# EAGLE schematic matherBoard (EAGLE 9.3.1)

## Sheet 1 of 2
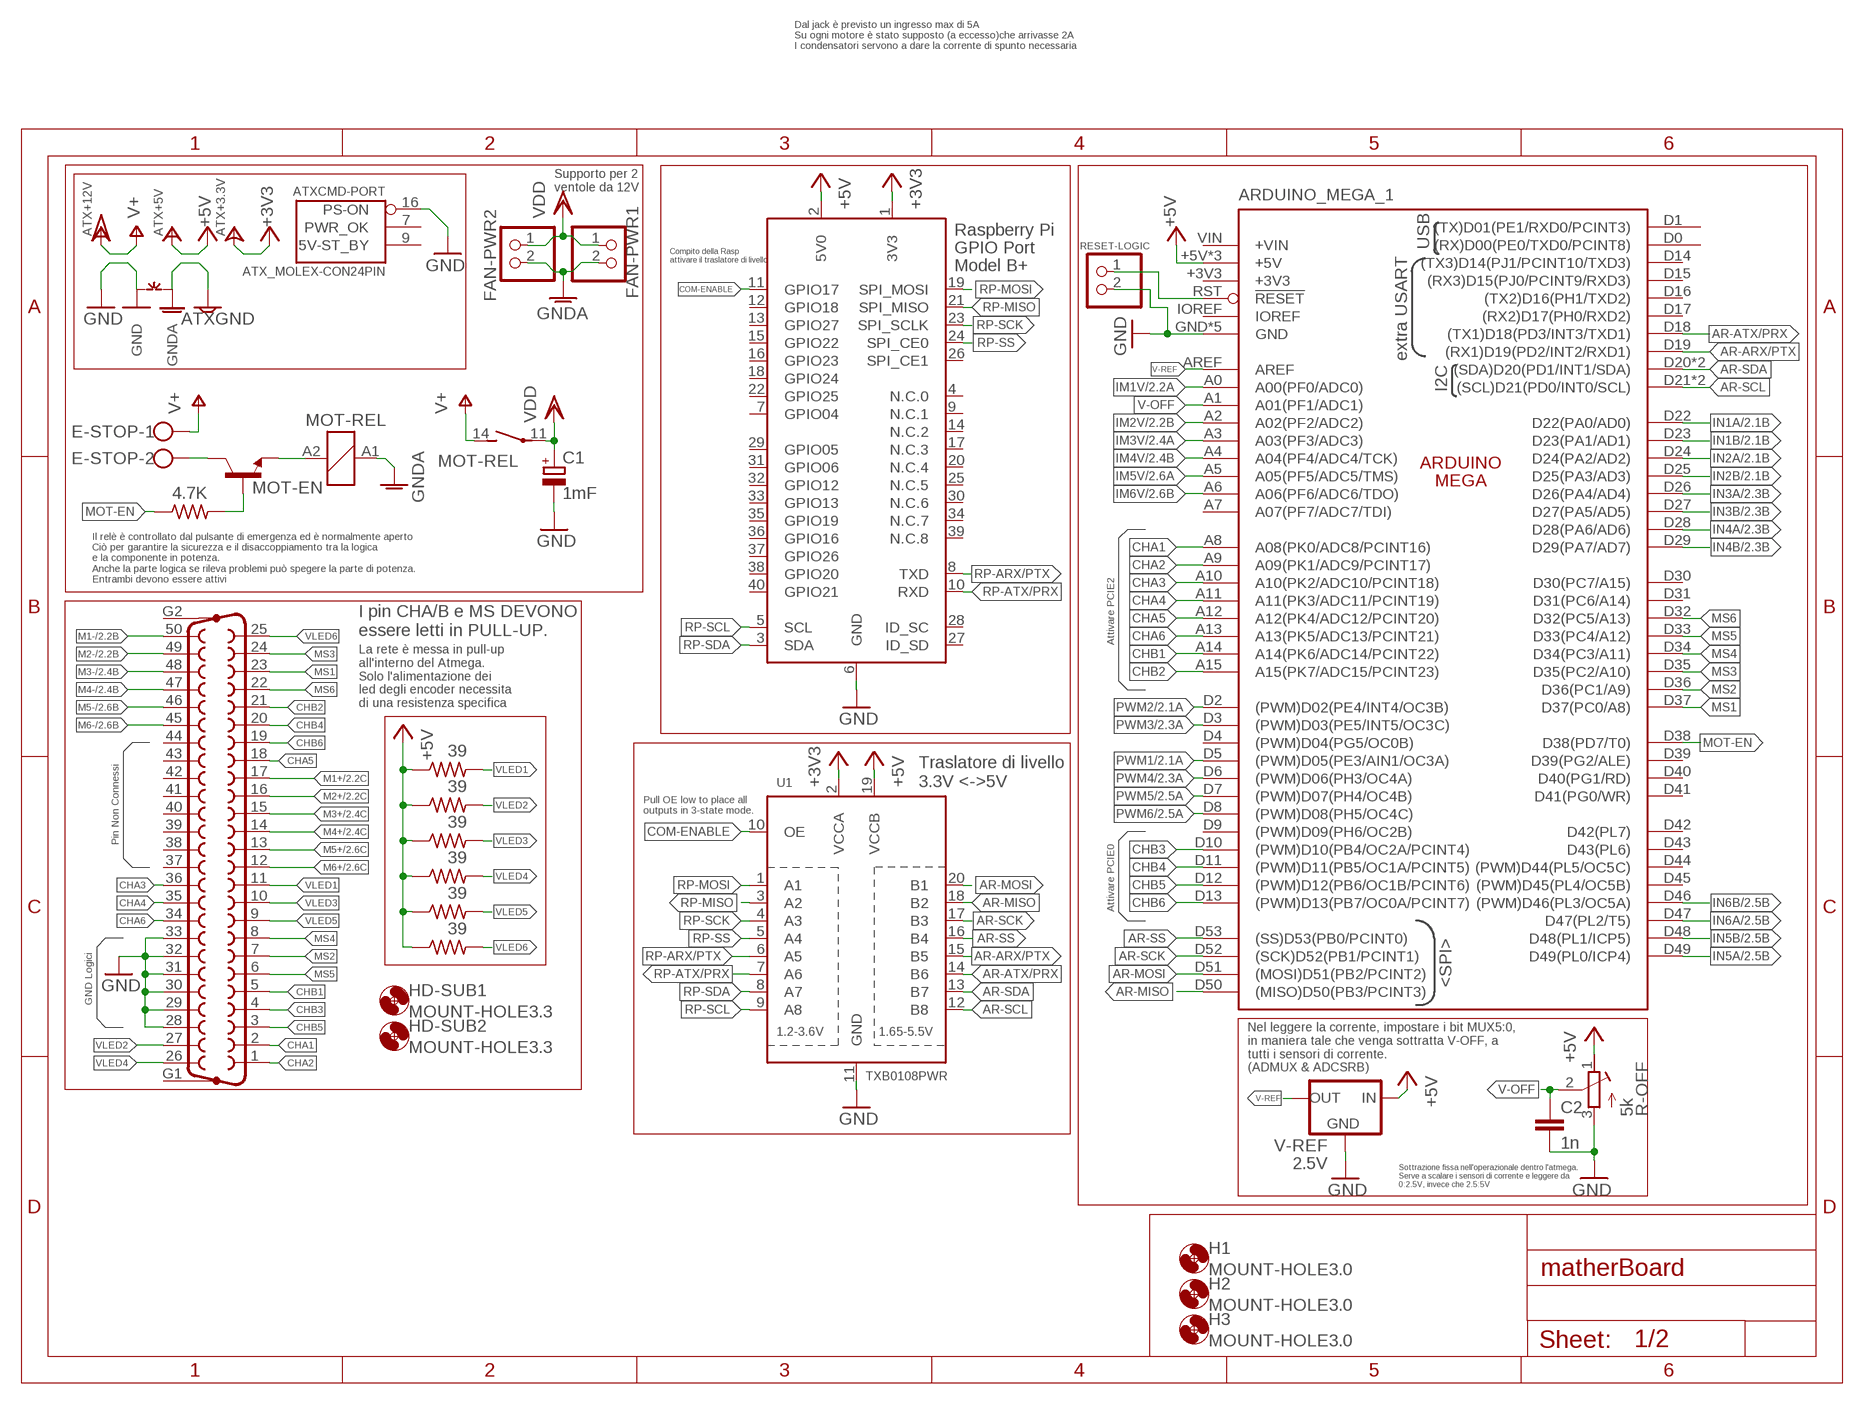
[diagram p0: schematic, sheet 1]

### Parts
ARDUINO_MEGA_1  MEGA_ARDUINONO-HOLE  [MEGA-NO-HOLE]
ATX  ATX_MOLEX-CON24PIN  [5566-24]
C1  1mF  CPOL-EUE5-13  [E5-13]
C2  1n  C-EU025-024X044  [C025-024X044]
D-SUB50  F50VP  [F50VP]
E-STOP  W237-102  [W237-102]
FAN-PWR1  PINHD-1X2  [1X02]
FAN-PWR2  PINHD-1X2  [1X02]
H1  MOUNT-HOLE3.0  [3,0]
H2  MOUNT-HOLE3.0  [3,0]
H3  MOUNT-HOLE3.0  [3,0]
HD-SUB1  MOUNT-HOLE3.3  [3,3]
HD-SUB2  MOUNT-HOLE3.3  [3,3]
MOT-EN  2N5550-NPN-TO92-CBE  [TO92-CBE]
MOT-REL  RP530006  [RP53]
R1  39  R-US_0204/5  [0204/5]
R2  39  R-US_0204/5  [0204/5]
R3  39  R-US_0204/5  [0204/5]
R4  39  R-US_0204/5  [0204/5]
R5  39  R-US_0204/5  [0204/5]
R6  39  R-US_0204/5  [0204/5]
R7  4.7K  R-US_0204/7  [0204/7]
R-OFF  5k  R-TRIMMT93YA  [RTRIMT93YA]
RASPBERRY-PY  RASPI_GPIO_B+_BOX  [RASPI_GPIO_B+_BOX]
RESET-LOGIC  PINHD-1X2  [1X02]
U1  TXB0108PWR  [TSSOP20]
V-REF  2.5V  XC63FPM  [SOT23]
~NUDEV~1  GND-GNDA1,27MM  [GND-GNDA-1,27MM]

### Nets
+3V3: ATX.1(+3.3V:+3V3-ATX) ATX.2(+3.3V:+3V3-ATX) ATX.12(+3.3V:+3V3-ATX) ATX.13(+3.3V:+3V3-ATX) RASPBERRY-PY.1(3V3) U1.2(VCCA)
+5V [PLogic]: ARDUINO_MEGA_1.+5V ARDUINO_MEGA_1.+5V1(+5V) ARDUINO_MEGA_1.+5V2(+5V) ATX.4(+5V:+5V-ATX) ATX.6(+5V:+5V-ATX) ATX.21(+5V:+5V-ATX) ATX.22(+5V:+5V-ATX) ATX.23(+5V:+5V-ATX) R1.1 R2.1 R3.1 R4.1 R5.1 R6.1 R-OFF.1(E) RASPBERRY-PY.2(5V0) U1.19(VCCB) V-REF.3(IN) ; also sheet 2
AR-ARX/PTX: ARDUINO_MEGA_1.D19((RX1)D19(PD2/INT2/RXD1)) U1.15(B5)
AR-ATX/PRX: ARDUINO_MEGA_1.D18((TX1)D18(PD3/INT3/TXD1)) U1.14(B6)
AR-MISO: ARDUINO_MEGA_1.D50((MISO)D50(PB3/PCINT3)) U1.18(B2)
AR-MOSI: ARDUINO_MEGA_1.D51((MOSI)D51(PB2/PCINT2)) U1.20(B1)
AR-SCK: ARDUINO_MEGA_1.D52((SCK)D52(PB1/PCINT1)) U1.17(B3)
AR-SCL: ARDUINO_MEGA_1.D21((SCL)D21(PD0/INT0/SCL)) ARDUINO_MEGA_1.SCL1((SCL)D21(PD0/INT0/SCL)) U1.12(B8)
AR-SDA: ARDUINO_MEGA_1.D20((SDA)D20(PD1/INT1/SDA)) ARDUINO_MEGA_1.SDA1((SDA)D20(PD1/INT1/SDA)) U1.13(B7)
AR-SS: ARDUINO_MEGA_1.D53((SS)D53(PB0/PCINT0)) U1.16(B4)
CHA1: ARDUINO_MEGA_1.A8(A08(PK0/ADC8/PCINT16)) D-SUB50.2
CHA2: ARDUINO_MEGA_1.A9(A09(PK1/ADC9/PCINT17)) D-SUB50.1
CHA3: ARDUINO_MEGA_1.A10(A10(PK2/ADC10/PCINT18)) D-SUB50.36
CHA4: ARDUINO_MEGA_1.A11(A11(PK3/ADC11/PCINT19)) D-SUB50.35
CHA5: ARDUINO_MEGA_1.A12(A12(PK4/ADC12/PCINT20)) D-SUB50.18
CHA6: ARDUINO_MEGA_1.A13(A13(PK5/ADC13/PCINT21)) D-SUB50.34
CHB1: ARDUINO_MEGA_1.A14(A14(PK6/ADC14/PCINT22)) D-SUB50.5
CHB2: ARDUINO_MEGA_1.A15(A15(PK7/ADC15/PCINT23)) D-SUB50.21
CHB3: ARDUINO_MEGA_1.D10((PWM)D10(PB4/OC2A/PCINT4)) D-SUB50.4
CHB4: ARDUINO_MEGA_1.D11((PWM)D11(PB5/OC1A/PCINT5)) D-SUB50.20
CHB5: ARDUINO_MEGA_1.D12((PWM)D12(PB6/OC1B/PCINT6)) D-SUB50.3
CHB6: ARDUINO_MEGA_1.D13((PWM)D13(PB7/OC0A/PCINT7)) D-SUB50.19
COM-ENABLE: RASPBERRY-PY.11(GPIO17) U1.10(OE)
GND [PLogic]: ARDUINO_MEGA_1.GND ARDUINO_MEGA_1.GND1(GND) ARDUINO_MEGA_1.GND2(GND) ARDUINO_MEGA_1.GND3(GND) ARDUINO_MEGA_1.GND4(GND) ATX.16(CMD-PORT:PS-ON) C1.- C2.2 D-SUB50.28 D-SUB50.29 D-SUB50.30 D-SUB50.31 D-SUB50.32 D-SUB50.33 R-OFF.3(A) RASPBERRY-PY.6(GND) RESET-LOGIC.2 U1.11(GND) V-REF.1(GND) ~NUDEV~1.GND ; also sheet 2
GNDA [PowerJack]: ATX.3(GND:GND-ATX) ATX.5(GND:GND-ATX) ATX.8(GND:GND-ATX) ATX.15(GND:GND-ATX) ATX.17(GND:GND-ATX) ATX.18(GND:GND-ATX) ATX.19(GND:GND-ATX) ATX.24(GND:GND-ATX) FAN-PWR1.2 FAN-PWR2.2 MOT-REL.A1 ~NUDEV~1.GNDA ; also sheet 2
IM1V: ARDUINO_MEGA_1.A0(A00(PF0/ADC0)) ; also sheet 2
IM2V: ARDUINO_MEGA_1.A2(A02(PF2/ADC2)) ; also sheet 2
IM3V: ARDUINO_MEGA_1.A3(A03(PF3/ADC3)) ; also sheet 2
IM4V: ARDUINO_MEGA_1.A4(A04(PF4/ADC4/TCK)) ; also sheet 2
IM5V: ARDUINO_MEGA_1.A5(A05(PF5/ADC5/TMS)) ; also sheet 2
IM6V: ARDUINO_MEGA_1.A6(A06(PF6/ADC6/TDO)) ; also sheet 2
IN1A [PLogic]: ARDUINO_MEGA_1.D22(D22(PA0/AD0)) ; also sheet 2
IN1B [PLogic]: ARDUINO_MEGA_1.D23(D23(PA1/AD1)) ; also sheet 2
IN2A [PLogic]: ARDUINO_MEGA_1.D24(D24(PA2/AD2)) ; also sheet 2
IN2B [PLogic]: ARDUINO_MEGA_1.D25(D25(PA3/AD3)) ; also sheet 2
IN3A [PLogic]: ARDUINO_MEGA_1.D26(D26(PA4/AD4)) ; also sheet 2
IN3B [PLogic]: ARDUINO_MEGA_1.D27(D27(PA5/AD5)) ; also sheet 2
IN4A [PLogic]: ARDUINO_MEGA_1.D28(D28(PA6/AD6)) ; also sheet 2
IN4B [PLogic]: ARDUINO_MEGA_1.D29(D29(PA7/AD7)) ; also sheet 2
IN5A [PLogic]: ARDUINO_MEGA_1.D49(D49(PL0/ICP4)) ; also sheet 2
IN5B [PLogic]: ARDUINO_MEGA_1.D48(D48(PL1/ICP5)) ; also sheet 2
IN6A [PLogic]: ARDUINO_MEGA_1.D47(D47(PL2/T5)) ; also sheet 2
IN6B [PLogic]: ARDUINO_MEGA_1.D46((PWM)D46(PL3/OC5A)) ; also sheet 2
M1+ [PMot]: D-SUB50.17 ; also sheet 2
M1- [PMot]: D-SUB50.50 ; also sheet 2
M2+ [PMot]: D-SUB50.16 ; also sheet 2
M2- [PMot]: D-SUB50.49 ; also sheet 2
M3+ [PMot]: D-SUB50.15 ; also sheet 2
M3- [PMot]: D-SUB50.48 ; also sheet 2
M4+ [PMot]: D-SUB50.14 ; also sheet 2
M4- [PMot]: D-SUB50.47 ; also sheet 2
M5+ [PMot]: D-SUB50.13 ; also sheet 2
M5- [PMot]: D-SUB50.46 ; also sheet 2
M6+ [PMot]: D-SUB50.12 ; also sheet 2
M6- [PMot]: D-SUB50.45 ; also sheet 2
MOT-EN: ARDUINO_MEGA_1.D38(D38(PD7/T0)) R7.1
MS1: ARDUINO_MEGA_1.D37(D37(PC0/A8)) D-SUB50.23
MS2: ARDUINO_MEGA_1.D36(D36(PC1/A9)) D-SUB50.7
MS3: ARDUINO_MEGA_1.D35(D35(PC2/A10)) D-SUB50.24
MS4: ARDUINO_MEGA_1.D34(D34(PC3/A11)) D-SUB50.8
MS5: ARDUINO_MEGA_1.D33(D33(PC4/A12)) D-SUB50.6
MS6: ARDUINO_MEGA_1.D32(D32(PC5/A13)) D-SUB50.22
N$1 [PLogic]: E-STOP.2 MOT-EN.C
N$2: MOT-EN.B R7.2
N$3: MOT-EN.E MOT-REL.A2
N$5: ARDUINO_MEGA_1.RST(!RESET) RESET-LOGIC.1
PWM1 [PLogic]: ARDUINO_MEGA_1.D5((PWM)D05(PE3/AIN1/OC3A)) ; also sheet 2
PWM2 [PLogic]: ARDUINO_MEGA_1.D2((PWM)D02(PE4/INT4/OC3B)) ; also sheet 2
PWM3 [PLogic]: ARDUINO_MEGA_1.D3((PWM)D03(PE5/INT5/OC3C)) ; also sheet 2
PWM4 [PLogic]: ARDUINO_MEGA_1.D6((PWM)D06(PH3/OC4A)) ; also sheet 2
PWM5 [PLogic]: ARDUINO_MEGA_1.D7((PWM)D07(PH4/OC4B)) ; also sheet 2
PWM6 [PLogic]: ARDUINO_MEGA_1.D8((PWM)D08(PH5/OC4C)) ; also sheet 2
RP-ARX/PTX: RASPBERRY-PY.8(TXD) U1.6(A5)
RP-ATX/PRX: RASPBERRY-PY.10(RXD) U1.7(A6)
RP-MISO: RASPBERRY-PY.21(SPI_MISO) U1.3(A2)
RP-MOSI: RASPBERRY-PY.19(SPI_MOSI) U1.1(A1)
RP-SCK: RASPBERRY-PY.23(SPI_SCLK) U1.4(A3)
RP-SCL: RASPBERRY-PY.5(SCL) U1.9(A8)
RP-SDA: RASPBERRY-PY.3(SDA) U1.8(A7)
RP-SS: RASPBERRY-PY.24(SPI_CE0) U1.5(A4)
V+ [PowerJack]: ATX.10(+12V:VCC/2) ATX.11(+12V:VCC/2) E-STOP.1 MOT-REL.14(2:S)
V-OFF: ARDUINO_MEGA_1.A1(A01(PF1/ADC1)) C2.1 R-OFF.2(S)
V-REF: ARDUINO_MEGA_1.AREF V-REF.2(OUT)
VDD [PowerJack]: C1.+ FAN-PWR1.1 FAN-PWR2.1 MOT-REL.11(2:P) ; also sheet 2
VLED1 [PLogic]: D-SUB50.11 R1.2
VLED2 [PLogic]: D-SUB50.27 R2.2
VLED3 [PLogic]: D-SUB50.10 R3.2
VLED4 [PLogic]: D-SUB50.26 R4.2
VLED5 [PLogic]: D-SUB50.9 R5.2
VLED6 [PLogic]: D-SUB50.25 R6.2
Unconnected: ARDUINO_MEGA_1.+3V3 ARDUINO_MEGA_1.A7(A07(PF7/ADC7/TDI)) ARDUINO_MEGA_1.D0((RX)D00(PE0/TXD0/PCINT8)) ARDUINO_MEGA_1.D1((TX)D01(PE1/RXD0/PCINT3)) ARDUINO_MEGA_1.D4((PWM)D04(PG5/OC0B)) ARDUINO_MEGA_1.D9((PWM)D09(PH6/OC2B)) ARDUINO_MEGA_1.D14((TX3)D14(PJ1/PCINT10/TXD3)) ARDUINO_MEGA_1.D15((RX3)D15(PJ0/PCINT9/RXD3)) ARDUINO_MEGA_1.D16((TX2)D16(PH1/TXD2)) ARDUINO_MEGA_1.D17((RX2)D17(PH0/RXD2)) ARDUINO_MEGA_1.D30(D30(PC7/A15)) ARDUINO_MEGA_1.D31(D31(PC6/A14)) ARDUINO_MEGA_1.D39(D39(PG2/ALE)) ARDUINO_MEGA_1.D40(D40(PG1/RD)) ARDUINO_MEGA_1.D41(D41(PG0/WR)) ARDUINO_MEGA_1.D42(D42(PL7)) ARDUINO_MEGA_1.D43(D43(PL6)) ARDUINO_MEGA_1.D44((PWM)D44(PL5/OC5C)) ARDUINO_MEGA_1.D45((PWM)D45(PL4/OC5B)) ARDUINO_MEGA_1.IOREF ARDUINO_MEGA_1.VIN(+VIN) ATX.7(CMD-PORT:PWR_OK) ATX.9(CMD-PORT:5V-ST_BY) ATX.14(-12V:-12V-ATX) ATX.20(-5V:-5V-ATX) D-SUB50.37 D-SUB50.38 D-SUB50.39 D-SUB50.40 D-SUB50.41 D-SUB50.42 D-SUB50.43 D-SUB50.44 D-SUB50.G1 D-SUB50.G2 RASPBERRY-PY.4(N.C.0) RASPBERRY-PY.7(GPIO04) RASPBERRY-PY.9(N.C.1) RASPBERRY-PY.12(GPIO18) RASPBERRY-PY.13(GPIO27) RASPBERRY-PY.14(N.C.2) RASPBERRY-PY.15(GPIO22) RASPBERRY-PY.16(GPIO23) RASPBERRY-PY.17(N.C.3) RASPBERRY-PY.18(GPIO24) RASPBERRY-PY.20(N.C.4) RASPBERRY-PY.22(GPIO25) RASPBERRY-PY.25(N.C.5) RASPBERRY-PY.26(SPI_CE1) RASPBERRY-PY.27(ID_SD) RASPBERRY-PY.28(ID_SC) RASPBERRY-PY.29(GPIO05) RASPBERRY-PY.30(N.C.6) RASPBERRY-PY.31(GPIO06) RASPBERRY-PY.32(GPIO12) RASPBERRY-PY.33(GPIO13) RASPBERRY-PY.34(N.C.7) RASPBERRY-PY.35(GPIO19) RASPBERRY-PY.36(GPIO16) RASPBERRY-PY.37(GPIO26) RASPBERRY-PY.38(GPIO20) RASPBERRY-PY.39(N.C.8) RASPBERRY-PY.40(GPIO21)

### Notes on the sheet
- Dal jack è previsto un ingresso max di 5A
  Su ogni motore è stato supposto (a eccesso)che arrivasse 2A
  I condensatori servono a dare la corrente di spunto necessaria
- Supporto per 2
  ventole da 12V
- Compito della Rasp 
  attivare il traslatore di livello
- Il relè è controllato dal pulsante di emergenza ed è normalmente aperto
  Ciò per garantire la sicurezza e il disaccoppiamento tra la logica
  e la componente in potenza.
  Anche la parte logica se rileva problemi può spegere la parte di potenza.
  Entrambi devono essere attivi
- I pin CHA/B e MS DEVONO
  essere letti in PULL-UP.
- La rete è messa in pull-up
  all'interno del Atmega.
  Solo l'alimentazione dei
  led degli encoder necessita
  di una resistenza specifica
- Attivare PCIE2
- Traslatore di livello
  3.3V <->5V
- Pull OE low to place all
  outputs in 3-state mode.
- Pin Non Connessi
- Attivare PCIE0
- GND Logici
- Nel leggere la corrente, impostare i bit MUX5:0,
  in maniera tale che venga sottratta V-OFF, a 
  tutti i sensori di corrente.
  (ADMUX & ADCSRB)
- Sottrazione fissa nell'operazionale dentro l'atmega.
  Serve a scalare i sensori di corrente e leggere da
  0:2.5V, invece che 2.5:5V

## Sheet 2 of 2
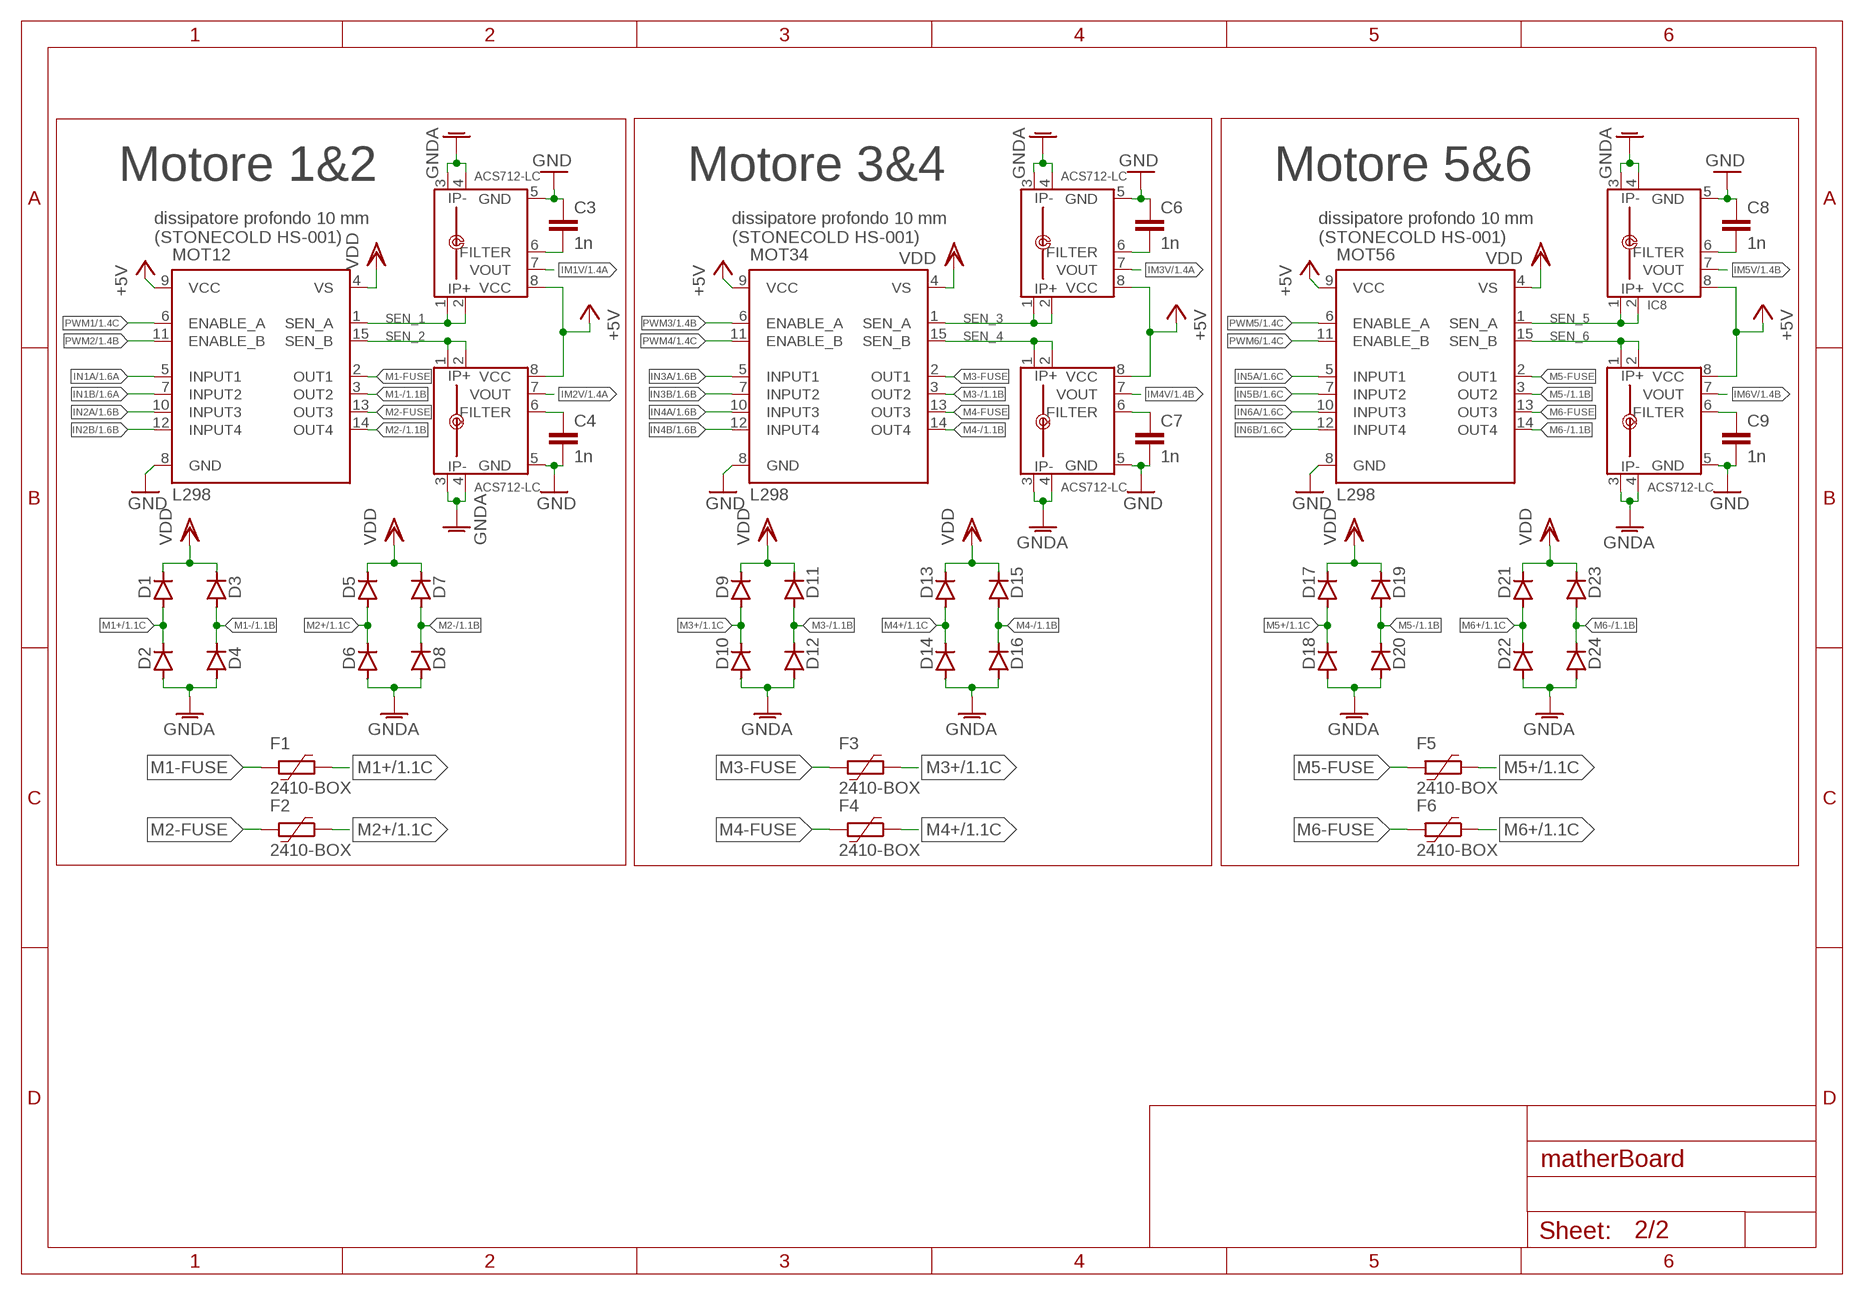
[diagram p1: schematic, sheet 2]

### Parts
C3  1n  C-EU025-024X044  [C025-024X044]
C4  1n  C-EU025-024X044  [C025-024X044]
C6  1n  C-EU025-024X044  [C025-024X044]
C7  1n  C-EU025-024X044  [C025-024X044]
C8  1n  C-EU025-024X044  [C025-024X044]
C9  1n  C-EU025-024X044  [C025-024X044]
D1  ES2D  [SMB]
D2  ES2D  [SMB]
D3  ES2D  [SMB]
D4  ES2D  [SMB]
D5  ES2D  [SMB]
D6  ES2D  [SMB]
D7  ES2D  [SMB]
D8  ES2D  [SMB]
D9  ES2D  [SMB]
D10  ES2D  [SMB]
D11  ES2D  [SMB]
D12  ES2D  [SMB]
D13  ES2D  [SMB]
D14  ES2D  [SMB]
D15  ES2D  [SMB]
D16  ES2D  [SMB]
D17  ES2D  [SMB]
D18  ES2D  [SMB]
D19  ES2D  [SMB]
D20  ES2D  [SMB]
D21  ES2D  [SMB]
D22  ES2D  [SMB]
D23  ES2D  [SMB]
D24  ES2D  [SMB]
F1  2410-BOX  [BELFUSE0679-3000-12]
F2  2410-BOX  [BELFUSE0679-3000-12]
F3  2410-BOX  [BELFUSE0679-3000-12]
F4  2410-BOX  [BELFUSE0679-3000-12]
F5  2410-BOX  [BELFUSE0679-3000-12]
F6  2410-BOX  [BELFUSE0679-3000-12]
IC2  ACS712-LC  [SOIC8]
IC3  ACS712-LC  [SOIC8]
IC5  ACS712-LC  [SOIC8]
IC6  ACS712-LC  [SOIC8]
IC8  ACS712-LC  [SOIC8]
IC9  ACS712-LC  [SOIC8]
MOT12  L298  [MULTIWATT-15]
MOT34  L298  [MULTIWATT-15]
MOT56  L298  [MULTIWATT-15]

### Nets
+5V [PLogic]: IC2.8(VCC) IC3.8(VCC) IC5.8(VCC) IC6.8(VCC) IC8.8(VCC) IC9.8(VCC) MOT12.9(VCC) MOT34.9(VCC) MOT56.9(VCC) ; also sheet 1
GND [PLogic]: C3.1 C4.2 C6.1 C7.2 C8.1 C9.2 IC2.5(GND) IC3.5(GND) IC5.5(GND) IC6.5(GND) IC8.5(GND) IC9.5(GND) MOT12.8(GND) MOT34.8(GND) MOT56.8(GND) ; also sheet 1
GNDA [PowerJack]: D2.A D4.A D6.A D8.A D10.A D12.A D14.A D16.A D18.A D20.A D22.A D24.A IC2.3(IP-) IC2.4(IP-1) IC3.3(IP-) IC3.4(IP-1) IC5.3(IP-) IC5.4(IP-1) IC6.3(IP-) IC6.4(IP-1) IC8.3(IP-) IC8.4(IP-1) IC9.3(IP-) IC9.4(IP-1) ; also sheet 1
IM1V: IC2.7(VOUT) ; also sheet 1
IM2V: IC3.7(VOUT) ; also sheet 1
IM3V: IC5.7(VOUT) ; also sheet 1
IM4V: IC6.7(VOUT) ; also sheet 1
IM5V: IC8.7(VOUT) ; also sheet 1
IM6V: IC9.7(VOUT) ; also sheet 1
IN1A [PLogic]: MOT12.5(INPUT1) ; also sheet 1
IN1B [PLogic]: MOT12.7(INPUT2) ; also sheet 1
IN2A [PLogic]: MOT12.10(INPUT3) ; also sheet 1
IN2B [PLogic]: MOT12.12(INPUT4) ; also sheet 1
IN3A [PLogic]: MOT34.5(INPUT1) ; also sheet 1
IN3B [PLogic]: MOT34.7(INPUT2) ; also sheet 1
IN4A [PLogic]: MOT34.10(INPUT3) ; also sheet 1
IN4B [PLogic]: MOT34.12(INPUT4) ; also sheet 1
IN5A [PLogic]: MOT56.5(INPUT1) ; also sheet 1
IN5B [PLogic]: MOT56.7(INPUT2) ; also sheet 1
IN6A [PLogic]: MOT56.10(INPUT3) ; also sheet 1
IN6B [PLogic]: MOT56.12(INPUT4) ; also sheet 1
M1+ [PMot]: D1.A D2.C F1.1 ; also sheet 1
M1- [PMot]: D3.A D4.C MOT12.3(OUT2) ; also sheet 1
M1-FUSE [PMot]: F1.2 MOT12.2(OUT1)
M2+ [PMot]: D5.A D6.C F2.1 ; also sheet 1
M2- [PMot]: D7.A D8.C MOT12.14(OUT4) ; also sheet 1
M2-FUSE [PMot]: F2.2 MOT12.13(OUT3)
M3+ [PMot]: D9.A D10.C F3.1 ; also sheet 1
M3- [PMot]: D11.A D12.C MOT34.3(OUT2) ; also sheet 1
M3-FUSE [PMot]: F3.2 MOT34.2(OUT1)
M4+ [PMot]: D13.A D14.C F4.1 ; also sheet 1
M4- [PMot]: D15.A D16.C MOT34.14(OUT4) ; also sheet 1
M4-FUSE [PMot]: F4.2 MOT34.13(OUT3)
M5+ [PMot]: D17.A D18.C F5.1 ; also sheet 1
M5- [PMot]: D19.A D20.C MOT56.3(OUT2) ; also sheet 1
M5-FUSE [PMot]: F5.2 MOT56.2(OUT1)
M6+ [PMot]: D21.A D22.C F6.1 ; also sheet 1
M6- [PMot]: D23.A D24.C MOT56.14(OUT4) ; also sheet 1
M6-FUSE [PMot]: F6.2 MOT56.13(OUT3)
N$4: C3.2 IC2.6(FILTER)
N$6: C4.1 IC3.6(FILTER)
N$9: C6.2 IC5.6(FILTER)
N$10: C7.1 IC6.6(FILTER)
N$13: C8.2 IC8.6(FILTER)
N$14: C9.1 IC9.6(FILTER)
PWM1 [PLogic]: MOT12.6(ENABLE_A) ; also sheet 1
PWM2 [PLogic]: MOT12.11(ENABLE_B) ; also sheet 1
PWM3 [PLogic]: MOT34.6(ENABLE_A) ; also sheet 1
PWM4 [PLogic]: MOT34.11(ENABLE_B) ; also sheet 1
PWM5 [PLogic]: MOT56.6(ENABLE_A) ; also sheet 1
PWM6 [PLogic]: MOT56.11(ENABLE_B) ; also sheet 1
SEN_1 [PMot]: IC2.1(IP+) IC2.2(IP+1) MOT12.1(SEN_A)
SEN_2 [PMot]: IC3.1(IP+) IC3.2(IP+1) MOT12.15(SEN_B)
SEN_3 [PMot]: IC5.1(IP+) IC5.2(IP+1) MOT34.1(SEN_A)
SEN_4 [PMot]: IC6.1(IP+) IC6.2(IP+1) MOT34.15(SEN_B)
SEN_5 [PMot]: IC8.1(IP+) IC8.2(IP+1) MOT56.1(SEN_A)
SEN_6 [PMot]: IC9.1(IP+) IC9.2(IP+1) MOT56.15(SEN_B)
VDD [PowerJack]: D1.C D3.C D5.C D7.C D9.C D11.C D13.C D15.C D17.C D19.C D21.C D23.C MOT12.4(VS) MOT34.4(VS) MOT56.4(VS) ; also sheet 1

### Notes on the sheet
- Motore 1&2 | Motore 3&4 | Motore 5&6
- dissipatore profondo 10 mm
  (STONECOLD HS-001)
- dissipatore profondo 10 mm
  (STONECOLD HS-001)
- dissipatore profondo 10 mm
  (STONECOLD HS-001)

## Library data of the parts
ARDUINO_MEGA_1 = ARDUINO_DODO:MEGA_ARDUINO
ATX = Personal:ATX_MOLEX-CON
C1 = rcl:CPOL-EU: POLARIZED CAPACITOR, European symbol; SPICEPREFIX: C
C2-C4 C6-C9 = rcl:C-EU: CAPACITOR, European symbol; SPICEPREFIX: C
D1-D24 = diode:ES2D: DIODE super fast rectifier, 2 A
D-SUB50 = con-subd:F50VP: SUB-D; OC_FARNELL: unknown; OC_NEWARK: unknown
E-STOP = con-wago-500:W237-102: WAGO SCREW CLAMP; MPN: 237-102; OC_FARNELL: unknown; OC_NEWARK: 70K9898
F1-F6 = polyfuse-smd_10:?: Polyfuse Resettable PTC Source: http://www.littelfuse.com/products/resettable-ptcs.aspx
FAN-PWR1 FAN-PWR2 RESET-LOGIC = pinhead:PINHD-1X2: PIN HEADER
H1-H3 HD-SUB1 HD-SUB2 = holes:MOUNT-HOLE: MOUNTING HOLE with drill center marker
IC2 IC3 IC5 IC6 IC8 IC9 = allegro-2:ACS712-LC
MOT12 MOT34 MOT56 = st-microelectronics:L298: DUAL FULL-BRIDGE DRIVER; MPN: L298N; OC_FARNELL: 1589425; OC_NEWARK: 32M1527
MOT-EN = transistor:*-NPN-: NPN Transistror BF959 corrected 2008.03.06
MOT-REL = relay:RP53*: Power PCB Relay RP I SCHRACK 1 pole 8 A Vertical version Source: http://www.schrack.com/.. 5845.pdf; OC_FARNELL: unknown; OC_NEWARK: unknown
R1-R7 = rcl:R-US_: RESISTOR, American symbol; SPICEPREFIX: R
R-OFF = rcl:R-TRIMM: Trimm resistor; SPICEMODEL: X; SPICEPREFIXL: POT
RASPBERRY-PY = raspberrypi_bastelstube_v13:RASPI_GPIO_B+: Only the 2x20 header connector, nothing else
U1 = TXB0108PWR:TXB0108PWR: 8-Bit Bi-Directional Level Shifter 1.2V-3.6V (VCCA) to 1.65V-5.5V (VCCB) bi-directional level shifter with auto direction sensing. Max data rate - VCCA 1.8V: 20Mbps (50ns), VCCA 3.3V: 100Mbps (10ns) Digikey: 296-21527-1-ND; AVAILABILITY: Unavailable; DESCRIPTION: 8-Bit Bidirectional Voltage-Level Translator with Auto Direction Sensing and +/-15-kV ESD Protect 20-TSSOP -40 to 85; MF: Texas Instruments; MP: TXB0108PWR; PACKAGE: TSSOP-20 Texas Instruments; PRICE: None
V-REF = v-reg:XC63FP: Positiv Voltage Regulators www.torex.co.jp/english/product/pro02/pdf/0201_xc62fp.pdf
~NUDEV~1 = ground-junctions:GND-GNDA: Connect GND - GNDA without DRC-Error, display layer 53 (54) to make copper (ROUTE) from GND to GNDA Select also layer 53 (54) in CAM-Job!

## Net classes
0 default: width 0.102 mm
1 PowerJack: width 1.778 mm, clearance 0.254 mm
2 PMot: width 0.635 mm, clearance 0.203 mm
3 PLogic: width 0.203 mm